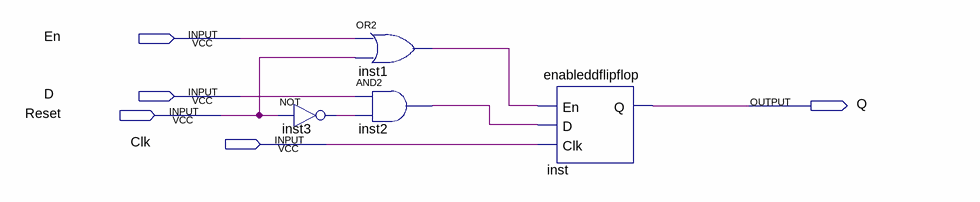
[diagram p0: schematic sheet]
// Quartus schematic erdflipflop.bdf as structural Verilog: 4 symbols, 5 pins
module erdflipflop (
  input  En,
  input  D,
  input  Reset,
  input  Clk,
  output Q
);

  wire inst1_out, inst2_out, inst3_out;

  not inst3 (inst3_out, Reset);
  or inst1 (inst1_out, En, Reset);
  and inst2 (inst2_out, D, inst3_out);
  enableddflipflop inst (.En(inst1_out), .D(inst2_out), .Clk(Clk), .Q(Q));
endmodule
